# Altium project AirtQuality.PrjPcb
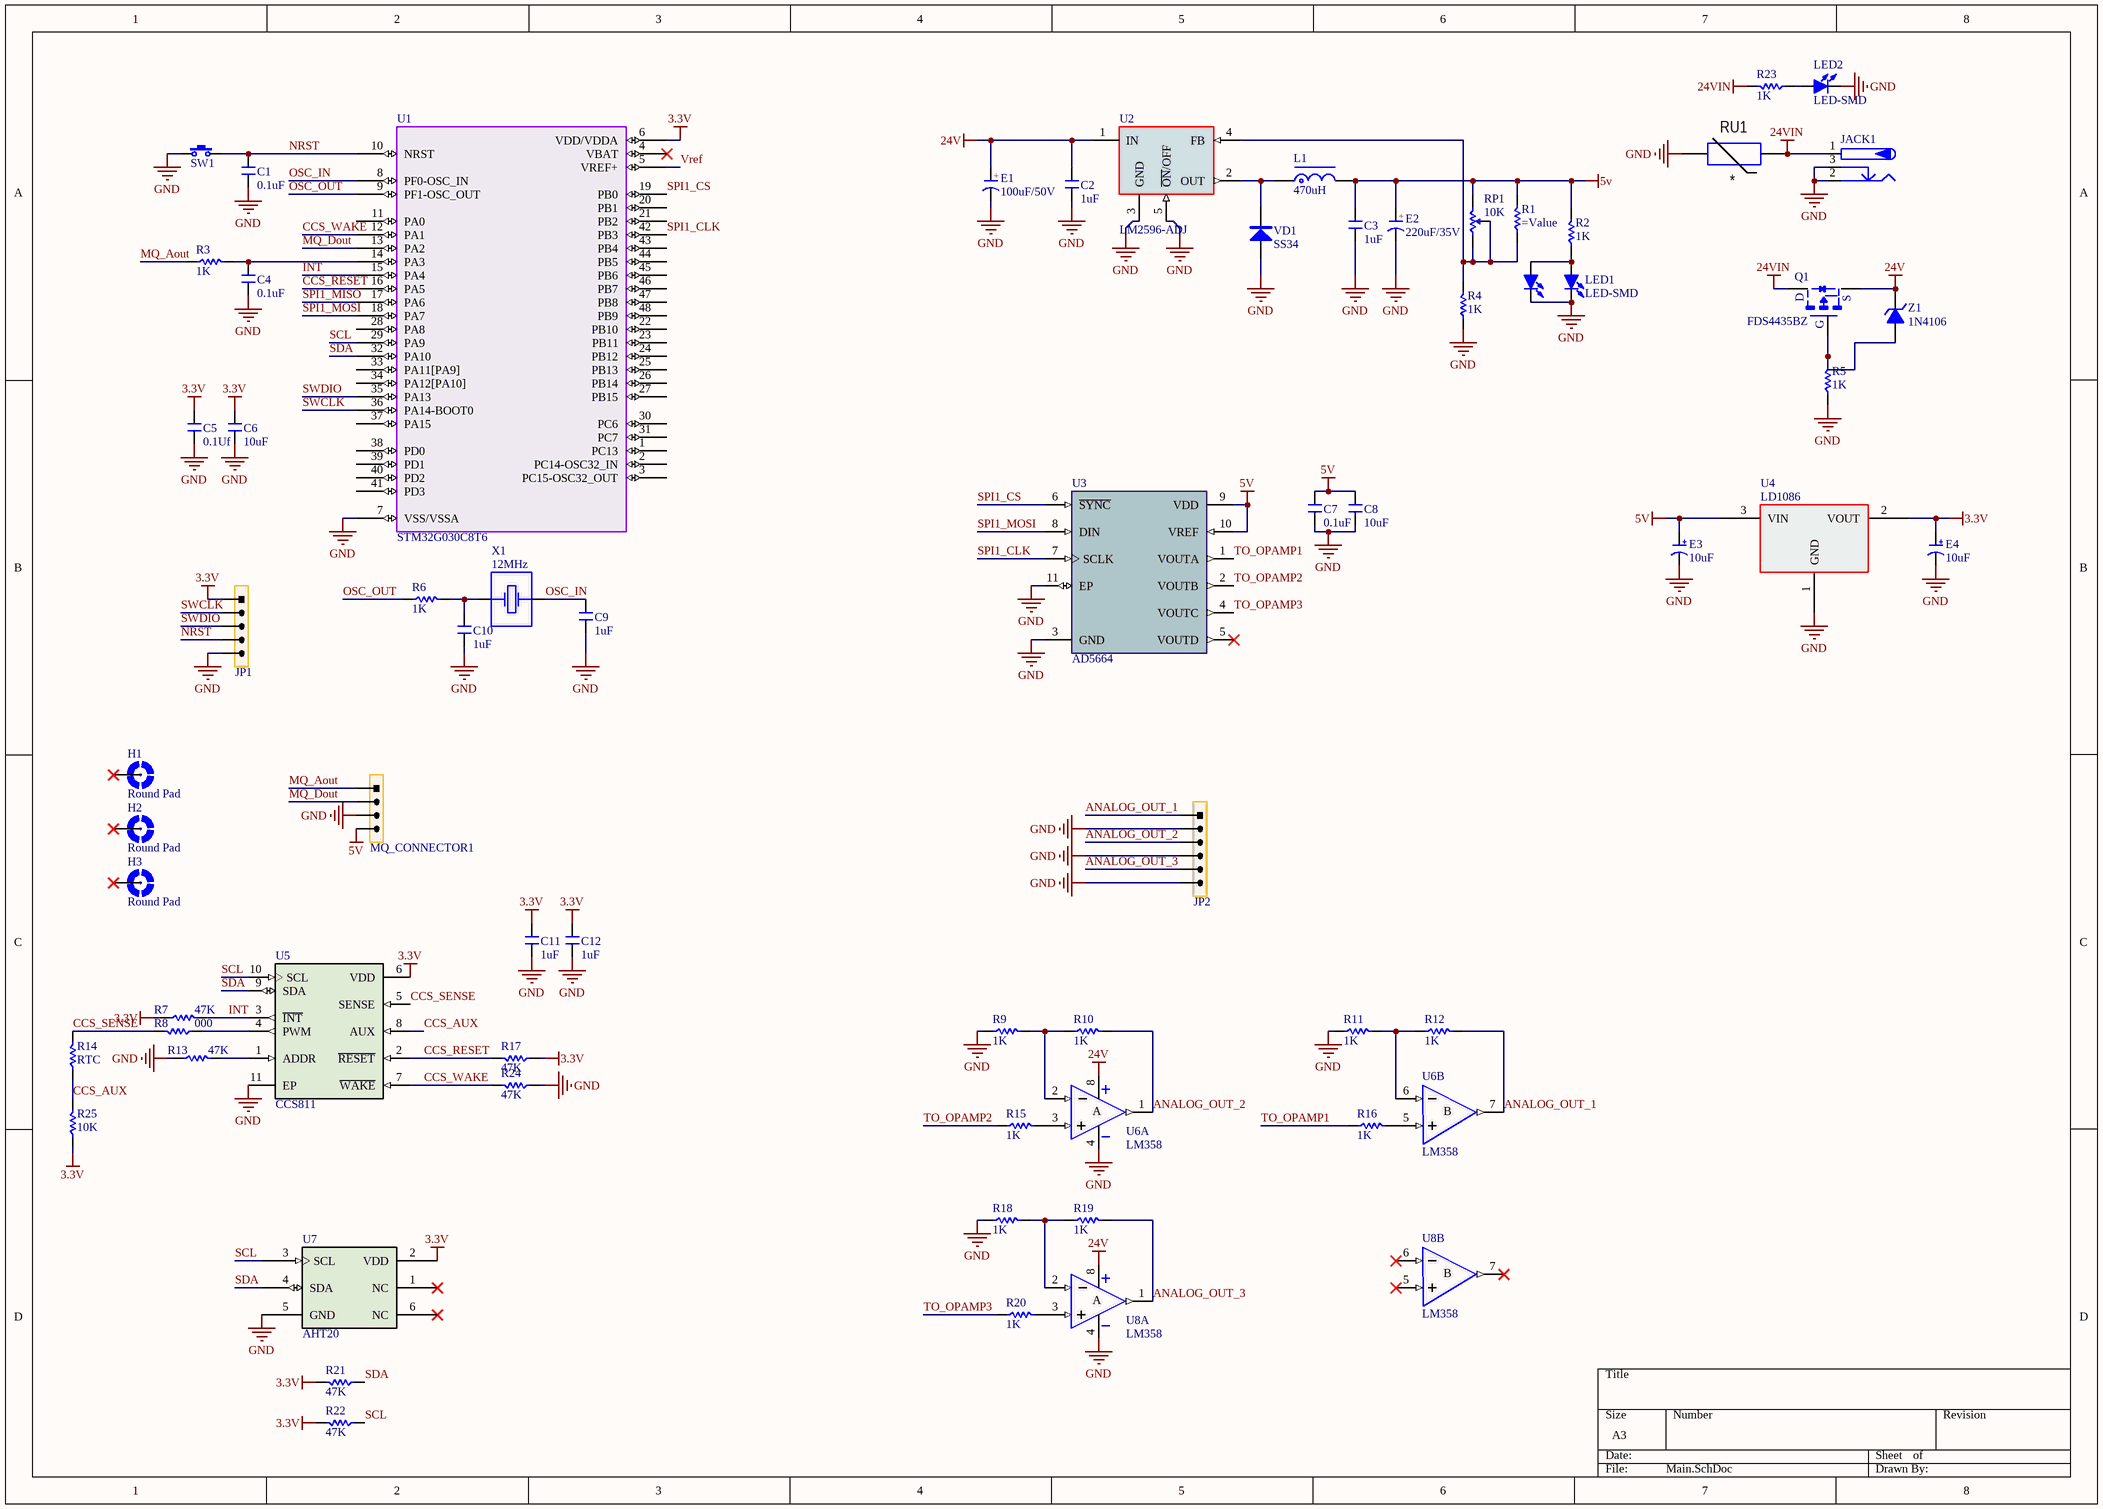
[diagram p0: Main.SchDoc]
1 sheet, 67 parts. Net scope: global (net labels, ports and power ports of the same name join across sheets).
Board file: AirQuality PCB.PcbDoc

## Sheet Main.SchDoc
size A3; SheetNumber: 1; SheetTotal: 1

### Parts
C1  0.1uF  [C 0805]
C2  1uF  [C 0805]
C3  1uF  [C 0805]
C4  0.1uF  [C 0805]
C5  0.1Uf  [C 0805]
C6  10uF  [C 0805]
C7  0.1uF  [C 0805]
C8  10uF  [C 0805]
C9  1uF  [C 0805]
C10  1uF  [C 0805]
C11  1uF  [C 0805]
C12  1uF  [C 0805]
E1  100uF/50V  [CM E(8*10.2)]
E2  220uF/35V  [CM E(8*10.2)]
E3  10uF  [CM C(5*5.4)]
E4  10uF  [CM C(5*5.4)]
H1  Round Pad  [P3.0C]  (no BOM)
H2  Round Pad  [P3.0C]  (no BOM)
H3  Round Pad  [P3.0C]  (no BOM)
JACK1  3.5*1.3  [DC-005]  (value not drawn)
JP1  HDR-1X5  [HDR-1X5]  (value not drawn)
JP2  HDR-1X6  [KF301-6P]  (value not drawn)
L1  470uH  [CDRH127]
LED1  LED-SMD  [LED 0805R]
LED2  LED-SMD  [LED 0805R]
LED3  红色  [LED 3MM-G]  (value not drawn)
MQ_CONNECTOR1  HDR-1X4  [HDR-1X4]  (value not drawn)
Q1  FDS4435BZ  [SOP8-E3]
R1  (no value)  [R 0805]
R2  1K  [R 0805]
R3  1K  [R 0805]
R4  1K  [R 0805]
R5  1K  [R 0805]
R6  1K  [R 0805]
R7  47K  [R 0805]
R8  000  [R 0805]
R9  1K  [R 0805]
R10  1K  [R 0805]
R11  1K  [R 0805]
R12  1K  [R 0805]
R13  47K  [R 0805]
R14  RTC  [R 0805]
R15  1K  [R 0805]
R16  1K  [R 0805]
R17  47K  [R 0805]
R18  1K  [R 0805]
R19  1K  [R 0805]
R20  1K  [R 0805]
R21  47K  [R 0805]
R22  47K  [R 0805]
R23  1K  [R 0805]
R24  47K  [R 0805]
R25  10K  [R 0805]
RP1  10K  [3296W]
RU1  *  [Varistor Short Hieght - Straight]
SW1  3x6x5  [TSW SMD-3*6*2.5]  (value not drawn)
U1  STM32G030C8T6  [LQFP48 7X7_N]
U2  LM2596-ADJ  [TO263-5A]
U3  AD5664  [LFCSP -10]
U4  LD1086  [TO252]
U5  CCS811  [CCS811]
U6  LM358  [SOP8_N]  (parts A,B of 2)
U7  AHT20  [AHT20]
U8  LM358  [SOP8_N]  (parts A,B of 2)
VD1  SS34  [SMA]
X1  12MHz  [XTAL-HC49S-SMD]
Z1  1N4106  [DO-213AA]

### Nets
3.3V: C5.2 C6.2 C11.2 C12.2 E4.1(A) JP1.1 R7.1 R17.1 R21.2 R22.2 R25.1 U1.6(VDD/VDDA) U4.2(VOUT) U5.6(VDD) U7.2(VDD)
5v: C3.2 C7.2 C8.2 E2.1(A) E3.1(A) L1.2 MQ_CONNECTOR1.4 R1.2 R2.2 RP1.2 U3.9(VDD) U3.10(VREF) U4.3(VIN)
24V: C2.2 E1.1(A) Q1.1-3(S) U2.1(IN) U6.8(VCC+) U8.8(VCC+) Z1.2(K)
24VIN: JACK1.1 Q1.5-8(D) R23.2 RU1.2
GND: C1.1 C2.1 C3.1 C4.1 C5.1 C6.1 C7.1 C8.1 C9.1 C10.1 C11.1 C12.1 E1.2(K) E2.2(K) E3.2(K) E4.2(K) JACK1.2 JACK1.3 JP1.5 JP2.2 JP2.4 JP2.6 LED1.2(K) LED2.2(K) LED3.2(K) MQ_CONNECTOR1.3 R4.1 R5.1 R9.1 R11.1 R13.1 R18.1 R24.1 RU1.1 SW1.1 U1.7(VSS/VSSA) U2.3(GND) U2.5(~{ON}/OFF) U3.3(GND) U3.11(EP) U4.1(GND) U5.11(EP) U6.4(VCC-) U7.5(GND) U8.4(VCC-) VD1.1(A)
SHIELD: H1.P H2.P H3.P
ANALOG_OUT_1: JP2.1 R12.2 U6.7(OUT2)
ANALOG_OUT_2: JP2.3 R10.2 U6.1(OUT1)
ANALOG_OUT_3: JP2.5 R19.2 U8.1(OUT1)
CCS_AUX: R14.1 R25.2 U5.8(AUX)
CCS_RESET: R17.2 U1.16(PA5) U5.2(~{RESET})
CCS_SENSE: R8.2 R14.2 U5.5(SENSE)
CCS_WAKE: R24.2 U1.12(PA1) U5.7(~{WAKE})
INT: R7.2 U1.15(PA4) U5.3(~{INT})
MQ_Aout: MQ_CONNECTOR1.1 R3.1
MQ_Dout: MQ_CONNECTOR1.2 U1.13(PA2)
NRST: C1.2 JP1.4 SW1.2 U1.10(NRST)
OSC_IN: C9.2 U1.8(PF0-OSC_IN) X1.2
OSC_OUT: R6.1 U1.9(PF1-OSC_OUT)
SCL: R22.1 U1.29(PA9) U5.10(SCL) U7.3(SCL)
SDA: R21.1 U1.32(PA10) U5.9(SDA) U7.4(SDA)
SPI1_CLK: U1.42(PB3) U3.7(SCLK)
SPI1_CS: U1.19(PB0) U3.6(~{SYNC})
SPI1_MISO: U1.17(PA6)
SPI1_MOSI: U1.18(PA7) U3.8(DIN)
SWCLK: JP1.2 U1.36(PA14-BOOT0)
SWDIO: JP1.3 U1.35(PA13)
TO_OPAMP1: R16.1 U3.1(VOUTA)
TO_OPAMP2: R15.1 U3.2(VOUTB)
TO_OPAMP3: R20.1 U3.4(VOUTC)
Vref: U1.5(VREF+)
NetC4_2: C4.2 R3.2 U1.14(PA3)
NetC10_2: C10.2 R6.2 X1.1
NetL1_1: L1.1 U2.2(OUT) VD1.2(K)
NetLED1_1: LED1.1(A) LED3.1(A) R2.1
NetLED2_1: LED2.1(A) R23.1
NetQ1_4: Q1.4(G) R5.2 Z1.1(A)
NetR1_1: R1.1 R4.2 RP1.1 RP1.ADJ U2.4(FB)
NetR8_1: R8.1 U5.4(PWM)
NetR9_2: R9.2 R10.1 U6.2(IN1-)
NetR11_2: R11.2 R12.1 U6.6(IN2-)
NetR13_2: R13.2 U5.1(ADDR)
NetR15_2: R15.2 U6.3(IN1+)
NetR16_2: R16.2 U6.5(IN2+)
NetR18_2: R18.2 R19.1 U8.2(IN1-)
NetR20_2: R20.2 U8.3(IN1+)

Not connected (* = marked no-connect by the designer): U1 1(PC13) 2(PC14-OSC32_IN) 3(PC15-OSC32_OUT) 4(VBAT)* 11(PA0) 20(PB1) 21(PB2) 22(PB10) 23(PB11) 24(PB12) 25(PB13) 26(PB14) 27(PB15) 28(PA8) 30(PC6) 31(PC7) 33(PA11[PA9]) 34(PA12[PA10]) 37(PA15) 38(PD0) 39(PD1) 40(PD2) 41(PD3) 43(PB4) 44(PB5) 45(PB6) 46(PB7) 47(PB8) 48(PB9); U3 5(VOUTD)*; U7 1(NC)* 6(NC)*; U8 5(IN2+)* 6(IN2-)* 7(OUT2)*

### Notes on the sheet
- (in symbol C-CM) +
- (in symbol LM358, part A) A
- (in symbol LM358, part B) B

### Library data of the parts
C1-C12 = C: Non-polar patch capacitor; BOM名称: 无极性贴片电容; 版权归属: 源创客; 学习资源: www.ooocke.com
E1-E4 = C-CM: Chip electrolytic capacitor; BOM名称: 贴片电解电容; 版权归属: 源创客; 学习资源: www.ooocke.com
H1-H3 = MOUNT-PAD-ROUND: MOUNTING PAD, round
JACK1 = P-DC: Low voltage power interface; BOM名称: DC电源接口; 版权归属: 源创客; 学习资源: www.ooocke.com
JP1 = Header 5: 5P Connector; BOM名称: 5P接插件; 版权归属: 源创客; 学习资源: www.ooocke.com
JP2 = Header 6: 6P Connector; BOM名称: 6P接插件; 版权归属: 源创客; 学习资源: www.ooocke.com
L1 = L-CDRH: Power shielded inductor; BOM名称: 功率屏蔽电感; 版权归属: 源创客; 学习资源: www.ooocke.com
LED1 LED2 = LED-SMD: Patch LED; BOM名称: 贴片LED; 版权归属: 源创客; 学习资源: www.ooocke.com
LED3 = LED-3MM: Plug-in LED; BOM名称: 插件LED; 版权归属: 源创客; 学习资源: www.ooocke.com
MQ_CONNECTOR1 = Header 4: 4P Connector; BOM名称: 4P接插件; 版权归属: 源创客; 学习资源: www.ooocke.com
R1-R25 = R: Chip resistor; 版权归属: 源创客; BOM名称: Chip resistor; 学习资源: www.ooocke.com
RP1 = RP-THD: Plug-in potentiometer; BOM名称: 插件电位器; 版权归属: 源创客; 学习资源: www.ooocke.com
RU1 = V: Versiror; Manufacturer: *; Model: *; HelpURL: *; ComponentKind: *; Value: *
SW1 = TSW 3x6: 3x6 tact switch; BOM名称: 3x6轻触开关; 版权归属: 源创客; 学习资源: www.ooocke.com
U2 = LM2596: DC step-down chip; BOM名称: DC稳压芯片; 版权归属: 源创客; 学习资源: www.ooocke.com
U4 = LD1086: Linear Voltage Regulator IC 1 Output 1.5A DPAK
U6 U8 = LM358: Dual op amp; BOM名称: 双路运放; 版权归属: 源创客; 学习资源: www.ooocke.com
VD1 = SS34: Schottky diodes; BOM名称: 肖特基二极管; 版权归属: 源创客; 属性: 40V/3A; 学习资源: www.ooocke.com
X1 = XTAL-2: 2-Pin crystal; BOM名称: 2脚晶振; 版权归属: 源创客; 学习资源: www.ooocke.com
Z1 = 1N4106: 12V/0.5W voltage regulator; BOM名称: 12V/0.5W稳压管; 版权归属: 源创客; 学习资源: www.ooocke.com